# Altium schematic sheet MCU.SchDoc: MCU
size A4; Author: Gerald Ebmer; DrawnBy: Gerald Ebmer; Engineer: Gerald Ebmer; Revision: 1.1; SheetNumber: 6; SheetTotal: 6; PageSetup: Record=PageOptions|CenterHorizontal=True|CenterVertical=True|PrintScale=1.00|XCorrection=1.00|YCorrection=1.00|PrintKind=0|BorderSize=5000000|LeftOffset=0|BottomOffset=0|Orientation=2|PaperLength=1000|PaperWidth=1000|Scale=100|PaperSource=7|PrintQuality=-3|MediaType=1|DitherType=10|PrintScaleMode=1|PaperKind=A4|PaperIndex=9
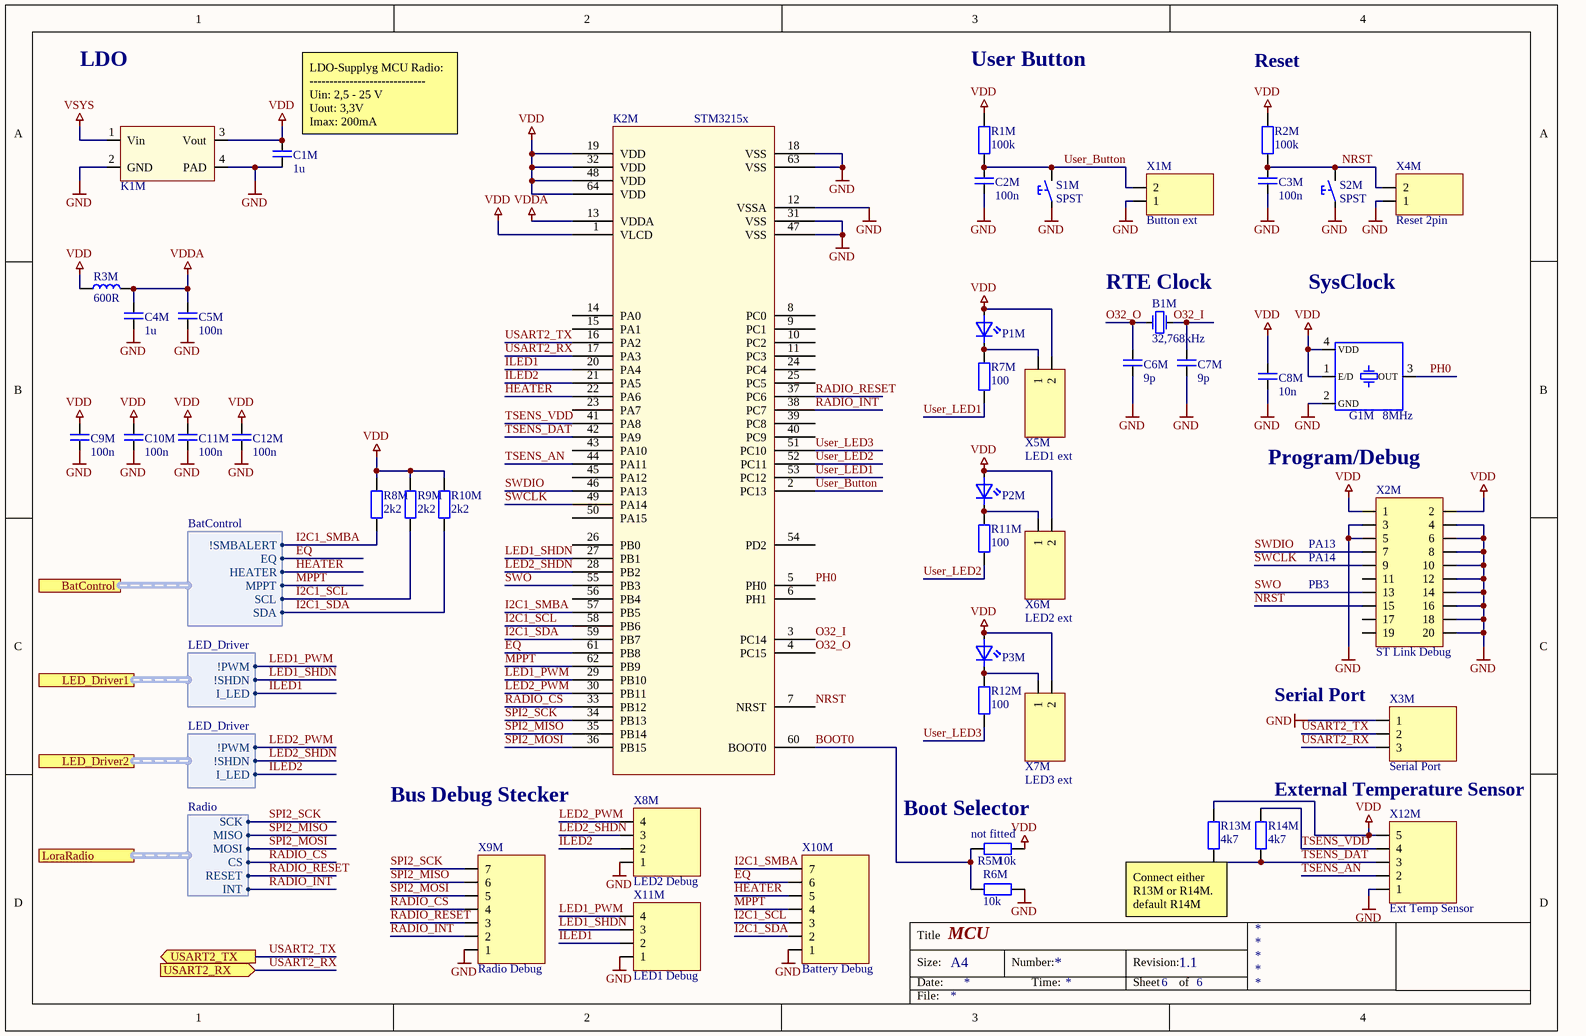
[diagram p0: MCU.SchDoc]

## Parts
B1M  32,768kHz  [0805]
C1M  1u  [0805]
C2M  100n  [0805]
C3M  100n  [0805]
C4M  1u  [0805]
C5M  100n  [0805]
C6M  9p  [0805]
C7M  9p  [0805]
C8M  10n  [0805]
C9M  100n  [0805]
C10M  100n  [0805]
C11M  100n  [0805]
C12M  100n  [0805]
G1M  8MHz  [SMT 3.2x2.5]
K1M  LDO_2  [SOT223-4L]  (value not drawn)
K2M  STM3215x  [LQFP64, 0.5mm pitch]
P1M  LED grün  [1206 D]  (value not drawn)
P2M  LED gelb  [1206 D]  (value not drawn)
P3M  LED rot  [1206 D]  (value not drawn)
R1M  100k  [0805]
R2M  100k  [0805]
R3M  600R  [0805]
R5M  10k  [0805]
R6M  10k  [0805]
R7M  100  [0805]
R8M  2k2  [0805]
R9M  2k2  [0805]
R10M  2k2  [0805]
R11M  100  [0805]
R12M  100  [0805]
R13M  4k7  [0805]
R14M  4k7  [0805]
S1M  SPST  [SPST_4x3]
S2M  SPST  [SPST_4x3]
X1M  Button ext  [Header, 2.54mm pitch, 2pin]
X2M  ST Link Debug  [Header, 2.54mm pitch, 2x10pin IDC socket male straight]
X3M  Serial Port  [Header, 2.54mm pitch, 3pin]
X4M  Reset 2pin  [Header, 2.54mm pitch, 2pin]
X5M  LED1 ext  [Header, 2.54mm pitch, 2pin]
X6M  LED2 ext  [Header, 2.54mm pitch, 2pin]
X7M  LED3 ext  [Header, 2.54mm pitch, 2pin]
X8M  LED2 Debug  [Header, 2.54mm pitch, 4pin]
X9M  Radio Debug  [Header, 2.54mm pitch, 7pin]
X10M  Battery Debug  [Header, 2.54mm pitch, 7pin]
X11M  LED1 Debug  [Header, 2.54mm pitch, 4pin]
X12M  Ext Temp Sensor  [Header, 2.54mm pitch, 5pin]

## Ports
BatControl (harness BatControl), LED_Driver1 (harness LED_Driver), LED_Driver2 (harness LED_Driver), LoraRadio (harness Radio), USART2_RX (in), USART2_TX (out)

## Harnesses
BatControl: !SMBALERT, EQ, HEATER, MPPT, SCL, SDA
LED_Driver: !PWM, !SHDN, I_LED
Radio: SCK, MISO, MOSI, CS, RESET, INT

## Nets
GND: C1M.1 C2M.1 C3M.1 C4M.1 C5M.1 C6M.1 C7M.1 C8M.1 C9M.1 C10M.1 C11M.1 C12M.1 G1M.2(GND) K1M.2(GND) K1M.4(PAD) K2M.12(VSSA) K2M.18(VSS) K2M.31(VSS) K2M.47(VSS) K2M.63(VSS) R6M.2 S1M.1(Mitte) S2M.1(Mitte) X1M.1 X2M.3 X2M.4 X2M.5 X2M.6 X2M.8 X2M.10 X2M.12 X2M.14 X2M.16 X2M.18 X2M.20 X3M.1 X4M.1 X8M.1 X9M.1 X10M.1 X11M.1 X12M.1
VDD: C1M.2 C8M.2 C9M.2 C10M.2 C11M.2 C12M.2 G1M.1(E/D) G1M.4(VDD) K1M.3(Vout) K2M.1(VLCD) K2M.19(VDD) K2M.32(VDD) K2M.48(VDD) K2M.64(VDD) P1M.2(Annode) P2M.2(Annode) P3M.2(Annode) R1M.2 R2M.2 R3M.1 R5M.2 R8M.2 R9M.2 R10M.2 R13M.2 X2M.1 X2M.2 X5M.2 X6M.2 X7M.2 X12M.5
VDDA: C4M.2 C5M.2 K2M.13(VDDA) R3M.2
VSYS: K1M.1(Vin)
BOOT0: K2M.60(BOOT0) R5M.1 R6M.1
EQ: K2M.61(PB8) X10M.6 ; port BatControl.EQ
HEATER: K2M.22(PA6) X10M.5 ; port BatControl.HEATER
I2C1_SCL: K2M.58(PB6) R9M.1 X10M.3 ; port BatControl.SCL
I2C1_SDA: K2M.59(PB7) R10M.1 X10M.2 ; port BatControl.SDA
I2C1_SMBA: K2M.57(PB5) R8M.1 X10M.7 ; port BatControl.!SMBALERT
ILED1: K2M.20(PA4) X11M.2 ; port LED_Driver1.I_LED
ILED2: K2M.21(PA5) X8M.2 ; port LED_Driver2.I_LED
LED1_PWM: K2M.29(PB10) X11M.4 ; port LED_Driver1.!PWM
LED1_SHDN: K2M.27(PB1) X11M.3 ; port LED_Driver1.!SHDN
LED2_PWM: K2M.30(PB11) X8M.4 ; port LED_Driver2.!PWM
LED2_SHDN: K2M.28(PB2) X8M.3 ; port LED_Driver2.!SHDN
MPPT: K2M.62(PB9) X10M.4 ; port BatControl.MPPT
NRST: C3M.2 K2M.7(NRST) R2M.1 S2M.2(Schließer) X2M.15 X4M.2
O32_I: B1M.2 C7M.2 K2M.3(PC14)
O32_O: B1M.1 C6M.2 K2M.4(PC15)
PH0: G1M.3(OUT) K2M.5(PH0)
RADIO_CS: K2M.33(PB12) X9M.4 ; port LoraRadio.CS
RADIO_INT: K2M.38(PC7) X9M.2 ; port LoraRadio.INT
RADIO_RESET: K2M.37(PC6) X9M.3 ; port LoraRadio.RESET
SPI2_MISO: K2M.35(PB14) X9M.6 ; port LoraRadio.MISO
SPI2_MOSI: K2M.36(PB15) X9M.5 ; port LoraRadio.MOSI
SPI2_SCK: K2M.34(PB13) X9M.7 ; port LoraRadio.SCK
SWCLK: K2M.49(PA14) X2M.9
SWDIO: K2M.46(PA13) X2M.7
SWO: K2M.55(PB3) X2M.13
TSENS_AN: K2M.44(PA11) X12M.2
TSENS_DAT: K2M.42(PA9) R13M.1 R14M.1 X12M.3
TSENS_VDD: K2M.41(PA8) R14M.2 X12M.4
USART2_RX: K2M.17(PA3) X3M.3 ; port USART2_RX
USART2_TX: K2M.16(PA2) X3M.2 ; port USART2_TX
User_Button: C2M.2 K2M.2(PC13) R1M.1 S1M.2(Schließer) X1M.2
User_LED1: K2M.53(PC12) R7M.1
User_LED2: K2M.52(PC11) R11M.1
User_LED3: K2M.51(PC10) R12M.1
NetP1M_1: P1M.1(Kathode) R7M.2 X5M.1
NetP2M_1: P2M.1(Kathode) R11M.2 X6M.1
NetP3M_1: P3M.1(Kathode) R12M.2 X7M.1

Not connected (* = marked no-connect by the designer): K2M 6(PH1) 8(PC0) 9(PC1) 10(PC2) 11(PC3) 14(PA0) 15(PA1) 23(PA7) 24(PC4) 25(PC5) 26(PB0) 39(PC8) 40(PC9) 43(PA10) 45(PA12) 50(PA15) 54(PD2) 56(PB4); X2M 11 17 19

## Notes on the sheet
- LDO
- User Button
- Reset
- (near C1M) LDO-Supplyg MCU Radio:
  -----------------------------
  Uin: 2,5 - 25 V
  Uout: 3,3V
  Imax: 200mA
- (near B1M) RTE Clock
- SysClock
- Program/Debug
- (near X2M) PA13
- (near X2M) PA14
- (near X2M) PB3
- (near X3M) Serial Port
- Bus Debug Stecker
- (near R5M) Boot Selector
- (near R5M) not fitted
- External Temperature Sensor
- (near R13M) Connect either R13M or R14M.
  default R14M fitted
- Title
- Size:
- Date:
- A4
- Number:
- Time:
- Revision:
- Sheet
- of
- File:

## Library data of the parts
B1M = Quarz: Lieferant: Farnell; Bestell-Nr.: 2467861; Preis: 1,58; Hersteller: ABRACON; Bezeichnung: ABS06-32.768KHZ-9-1-T; Bauform: 0805; Option: *
C1M C4M = Kondensator: Bezeichnung: C0805C105K3RACTU; Hersteller: KEMET; Lieferant: Farnell; Bestell-Nr.: 1637035; Bauform: 0805
C2M C3M C5M C9M C10M C11M C12M = Kondensator: Bezeichnung: 08055C104KAT2A; Hersteller: AVX; Lieferant: RS Components; Bestell-Nr.: 464-6688; Bauform: 0805
C6M C7M = Kondensator: Bezeichnung: MC0805N9R0D500CT; Hersteller: MULTICOMP; Lieferant: Farnell; Bestell-Nr.: 1759189; Bauform: 0805
C8M = Kondensator: Bezeichnung: C0805C103M5RACTU; Hersteller: Kemet; Lieferant: Farnell; Bestell-Nr.: 2581081; Bauform: 0805
G1M = Quarz Oszillator: Bezeichnung: ASEMB-8.000MHZ-LY-T; Bauform: SMD; Hersteller: ABRACON; Lieferant: Farnell; Bestell-Nr.: 2673051
K1M = LDO_2: Bezeichnung: MIC5201-3.3YS-TR; Bestell-Nr.: 910-1795; Lieferant: RS Components; Hersteller: Microchip; Preis: *; Bauform: *
K2M = STM32L15xRE_64: Lieferant: Farnell; Bestell-Nr.: 2469628; Hersteller: STMicroelectronics; Bezeichnung: STM32L152RET6; Bauform: SMD; Option: *
P1M = LED: Bezeichnung: KP-3216CGCK; Lieferant: Farnell; Hersteller: KINGBRIGHT; Bestell-Nr.: 2290333; Preis: *; Bauform: *
P2M = LED: Bezeichnung: KP-3216SYC; Lieferant: Farnell; Hersteller: KINGBRIGHT; Bestell-Nr.: 8529990; Preis: *; Bauform: *
P3M = LED: Bezeichnung: KP-3216EC; Lieferant: Farnell; Hersteller: KINGBRIGHT; Bestell-Nr.: 8530025; Preis: *; Bauform: *
R1M R2M = Widerstand: Bezeichnung: MCWR08X1003FTL; Lieferant: Farnell; Bestell-Nr.: 2447551; Hersteller: MULTICOMP; Bauform: 0805
R3M = Induktivität: EMI Filter; Bezeichnung: BMB2A0600BN3; Lieferant: Farnell; Bestell-Nr.: 2329425; Hersteller: TE Connectivity; Bauform: 0805
R5M R6M = Widerstand: Bezeichnung: MCWR08X1002FTL; Lieferant: Farnell; Bestell-Nr.: 2447553; Hersteller: MULTICOMP; Bauform: 0805
R7M R11M R12M = Widerstand: Bezeichnung: MCWR08X1000FTL; Lieferant: Farnell; Bestell-Nr.: 2447552; Hersteller: MULTICOMP; Bauform: 0805
R8M R9M R10M = Widerstand: Bezeichnung: MCWF08P2201FTL; Lieferant: Farnell; Bestell-Nr.: 2694118; Hersteller: MULTICOMP; Bauform: 0805
R13M R14M = Widerstand: Bezeichnung: MCWF08P4701FTL; Lieferant: Farnell; Bestell-Nr.: 2694141; Hersteller: MULTICOMP; Bauform: 0805
S1M S2M = SPST: single pole, single throw; Bestell-Nr.: 135-9374; Bezeichnung: PTS820 J25K SMTR LFS; Hersteller: C&K Components; Lieferant: Farnell; Bauform: *
X1M X4M X5M X6M X7M = Header 2pin: Hersteller: RS Pro; Lieferant: RS; Bezeichnung: Stiftleiste; Bestell-Nr.: 251-8086; Bauform: *; Preis: *
X2M = Header 2x10pin: Bezeichnung: 1761681-7; Bestell-Nr.: 680-1335; Lieferant: RS Components; Hersteller: TE Connectivity; Bauform: IDC 2x10 2.54mm pitch
X3M = Header 3pin: Hersteller: Molex; Bauform: Through Hole; Bezeichnung: 22-03-2031
X8M X11M = Header 4pin: Hersteller: *; Bestell-Nr.: *; Lieferant: *; Bezeichnung: *; Preis: *; Bauform: *
X9M X10M = Header 7pin: Bezeichnung: *; Preis: *; Bestell-Nr.: *; Hersteller: *; Lieferant: *; Bauform: *
X12M = Header 5pin: Bezeichnung: *; Preis: *; Bestell-Nr.: *; Hersteller: *; Lieferant: *; Bauform: *